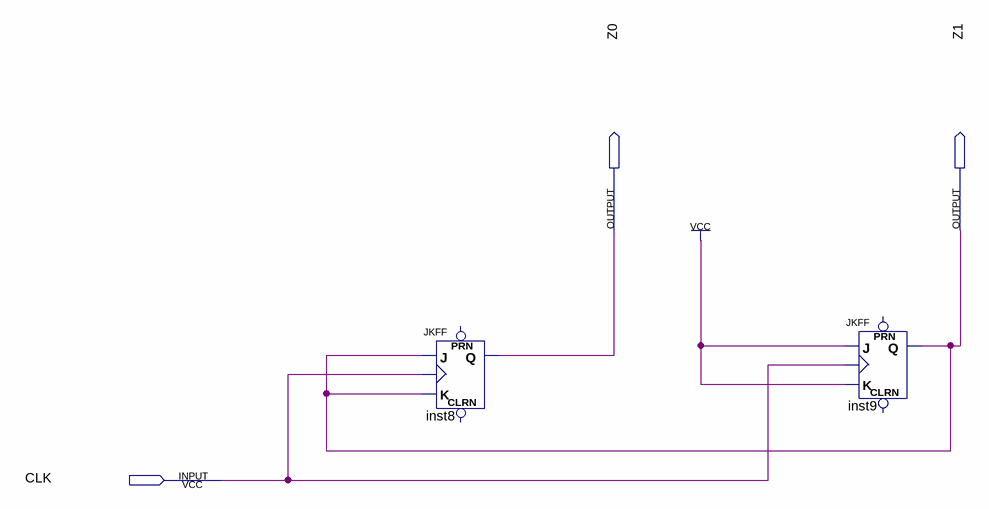
[diagram p0: schematic sheet]
// Quartus schematic Contador.bdf as structural Verilog: 2 symbols, 3 pins
module Contador (
  input  CLK,
  output Z0,
  output Z1
);

  JKFF inst8 (.K(Z1), .J(Z1), .CLK(CLK), .Q(Z0));  // open: PRN, CLRN
  JKFF inst9 (.K(1'b1), .J(1'b1), .CLK(CLK), .Q(Z1));  // open: PRN, CLRN
endmodule
